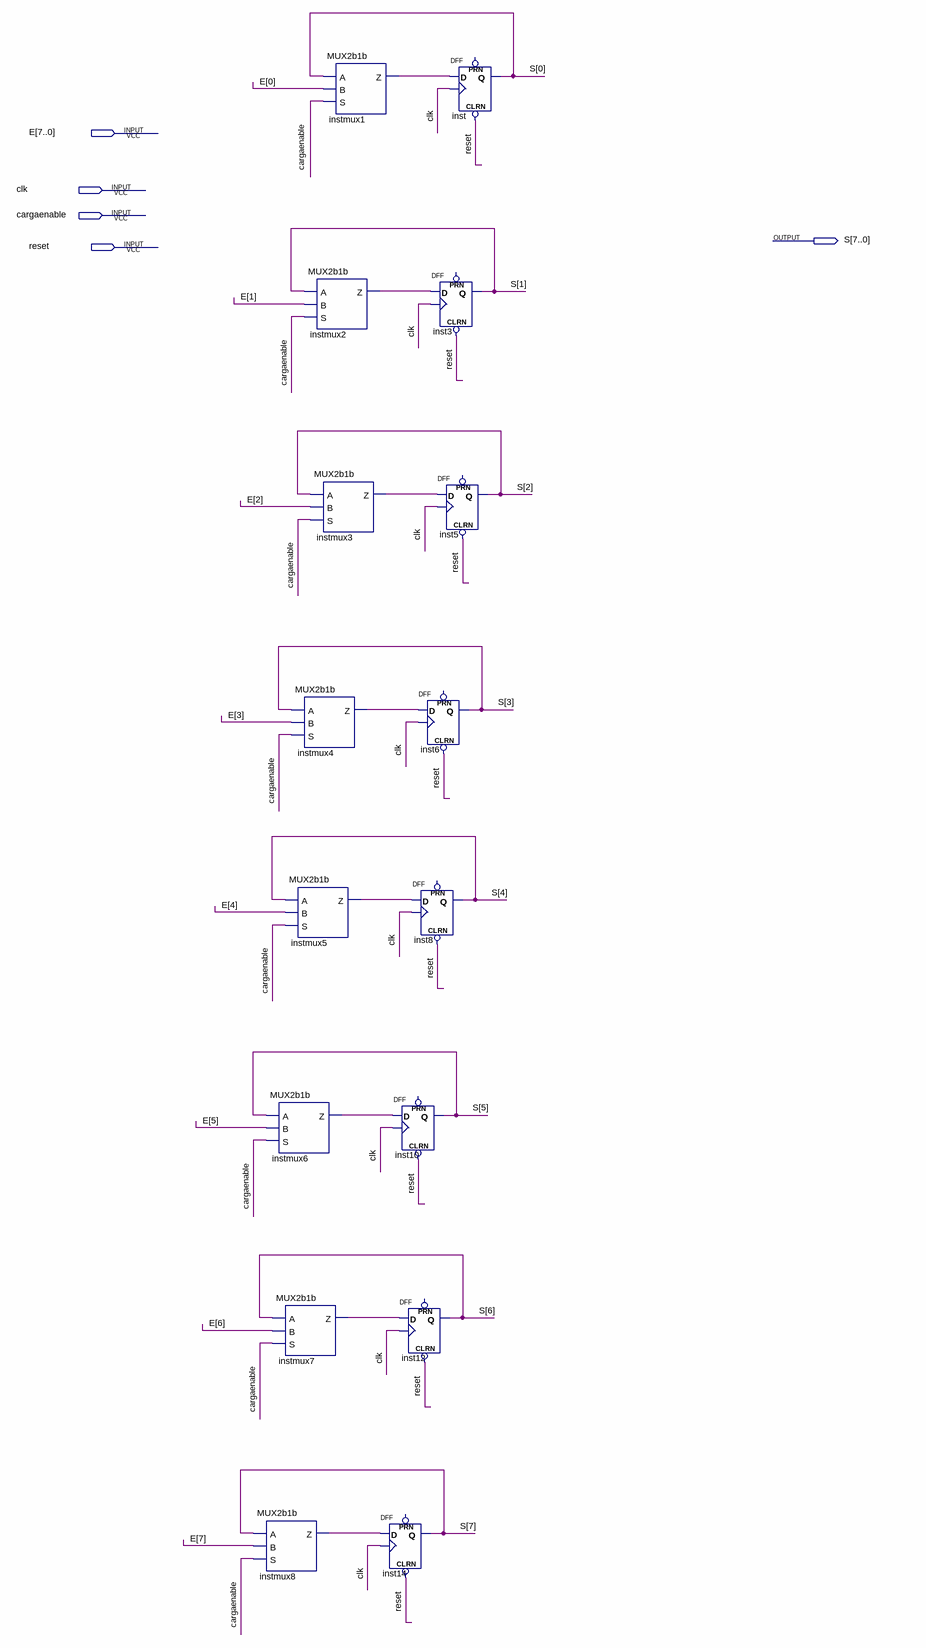
[diagram p0: schematic sheet]
// Quartus schematic register8b.bdf as structural Verilog: 16 symbols, 5 pins
module register8b (
  input  [7:0] E,
  input  clk,
  input  cargaenable,
  input  reset,
  output [7:0] S
);

  wire instmux1_z, instmux2_z, instmux3_z, instmux4_z, instmux5_z, instmux6_z, instmux7_z, instmux8_z;

  MUX2b1b instmux6 (.A(S[5]), .B(E[5]), .S(cargaenable), .Z(instmux6_z));
  MUX2b1b instmux7 (.A(S[6]), .B(E[6]), .S(cargaenable), .Z(instmux7_z));
  MUX2b1b instmux8 (.A(S[7]), .B(E[7]), .S(cargaenable), .Z(instmux8_z));
  MUX2b1b instmux1 (.A(S[0]), .B(E[0]), .S(cargaenable), .Z(instmux1_z));
  MUX2b1b instmux2 (.A(S[1]), .B(E[1]), .S(cargaenable), .Z(instmux2_z));
  MUX2b1b instmux3 (.A(S[2]), .B(E[2]), .S(cargaenable), .Z(instmux3_z));
  MUX2b1b instmux4 (.A(S[3]), .B(E[3]), .S(cargaenable), .Z(instmux4_z));
  MUX2b1b instmux5 (.A(S[4]), .B(E[4]), .S(cargaenable), .Z(instmux5_z));
  DFF inst6 (.CLRN(reset), .CLK(clk), .D(instmux4_z), .Q(S[3]));  // open: PRN
  DFF inst8 (.CLRN(reset), .CLK(clk), .D(instmux5_z), .Q(S[4]));  // open: PRN
  DFF inst10 (.CLRN(reset), .CLK(clk), .D(instmux6_z), .Q(S[5]));  // open: PRN
  DFF inst12 (.CLRN(reset), .CLK(clk), .D(instmux7_z), .Q(S[6]));  // open: PRN
  DFF inst14 (.CLRN(reset), .CLK(clk), .D(instmux8_z), .Q(S[7]));  // open: PRN
  DFF inst (.CLRN(reset), .CLK(clk), .D(instmux1_z), .Q(S[0]));  // open: PRN
  DFF inst3 (.CLRN(reset), .CLK(clk), .D(instmux2_z), .Q(S[1]));  // open: PRN
  DFF inst5 (.CLRN(reset), .CLK(clk), .D(instmux3_z), .Q(S[2]));  // open: PRN
endmodule
